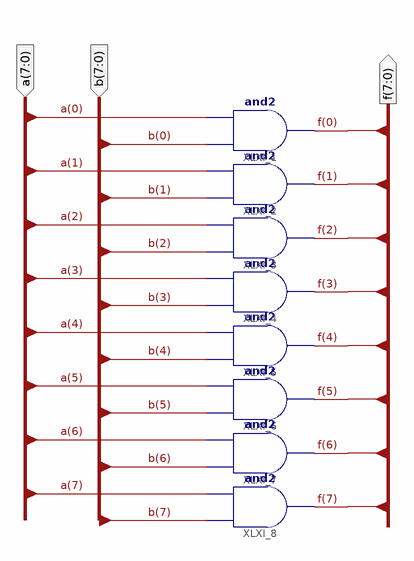
[diagram p0: schematic sheet 1]
// Xilinx ISE schematic and_8bit.sch (spartan3e) as structural Verilog: 8 symbols, 3 ports
module and_8bit (
  input  [7:0] b,
  input  [7:0] a,
  output [7:0] f
);

  and XLXI_1 (f[0], b[0], a[0]);
  and XLXI_2 (f[1], b[1], a[1]);
  and XLXI_3 (f[2], b[2], a[2]);
  and XLXI_4 (f[3], b[3], a[3]);
  and XLXI_5 (f[4], b[4], a[4]);
  and XLXI_6 (f[5], b[5], a[5]);
  and XLXI_7 (f[6], b[6], a[6]);
  and XLXI_8 (f[7], b[7], a[7]);
endmodule
